# Altium project CM4 IO_V1.10.PrjPcb (part 3 of 5)

## Sheet 11 Power-DC IN.SchDoc: CM4 IO
size 420 x 297 mm; Page Create Date: March  8, 1995; Page Number: 11; Page Size: A3; Comment: radxa_1010; Page Count: 19; RevCode: V1.10; Doc: 11 Power-DC IN; DsnPath: D:\WMS\黄工\[RC126]CM4_IO_V1.10\[RC126]_V1.10\CM4 IO_V1.10.DSN; SchematicName: CM4 IO V1.10; PageName: 11 Power-DC IN; PageSize: A3; TopSchematic: True
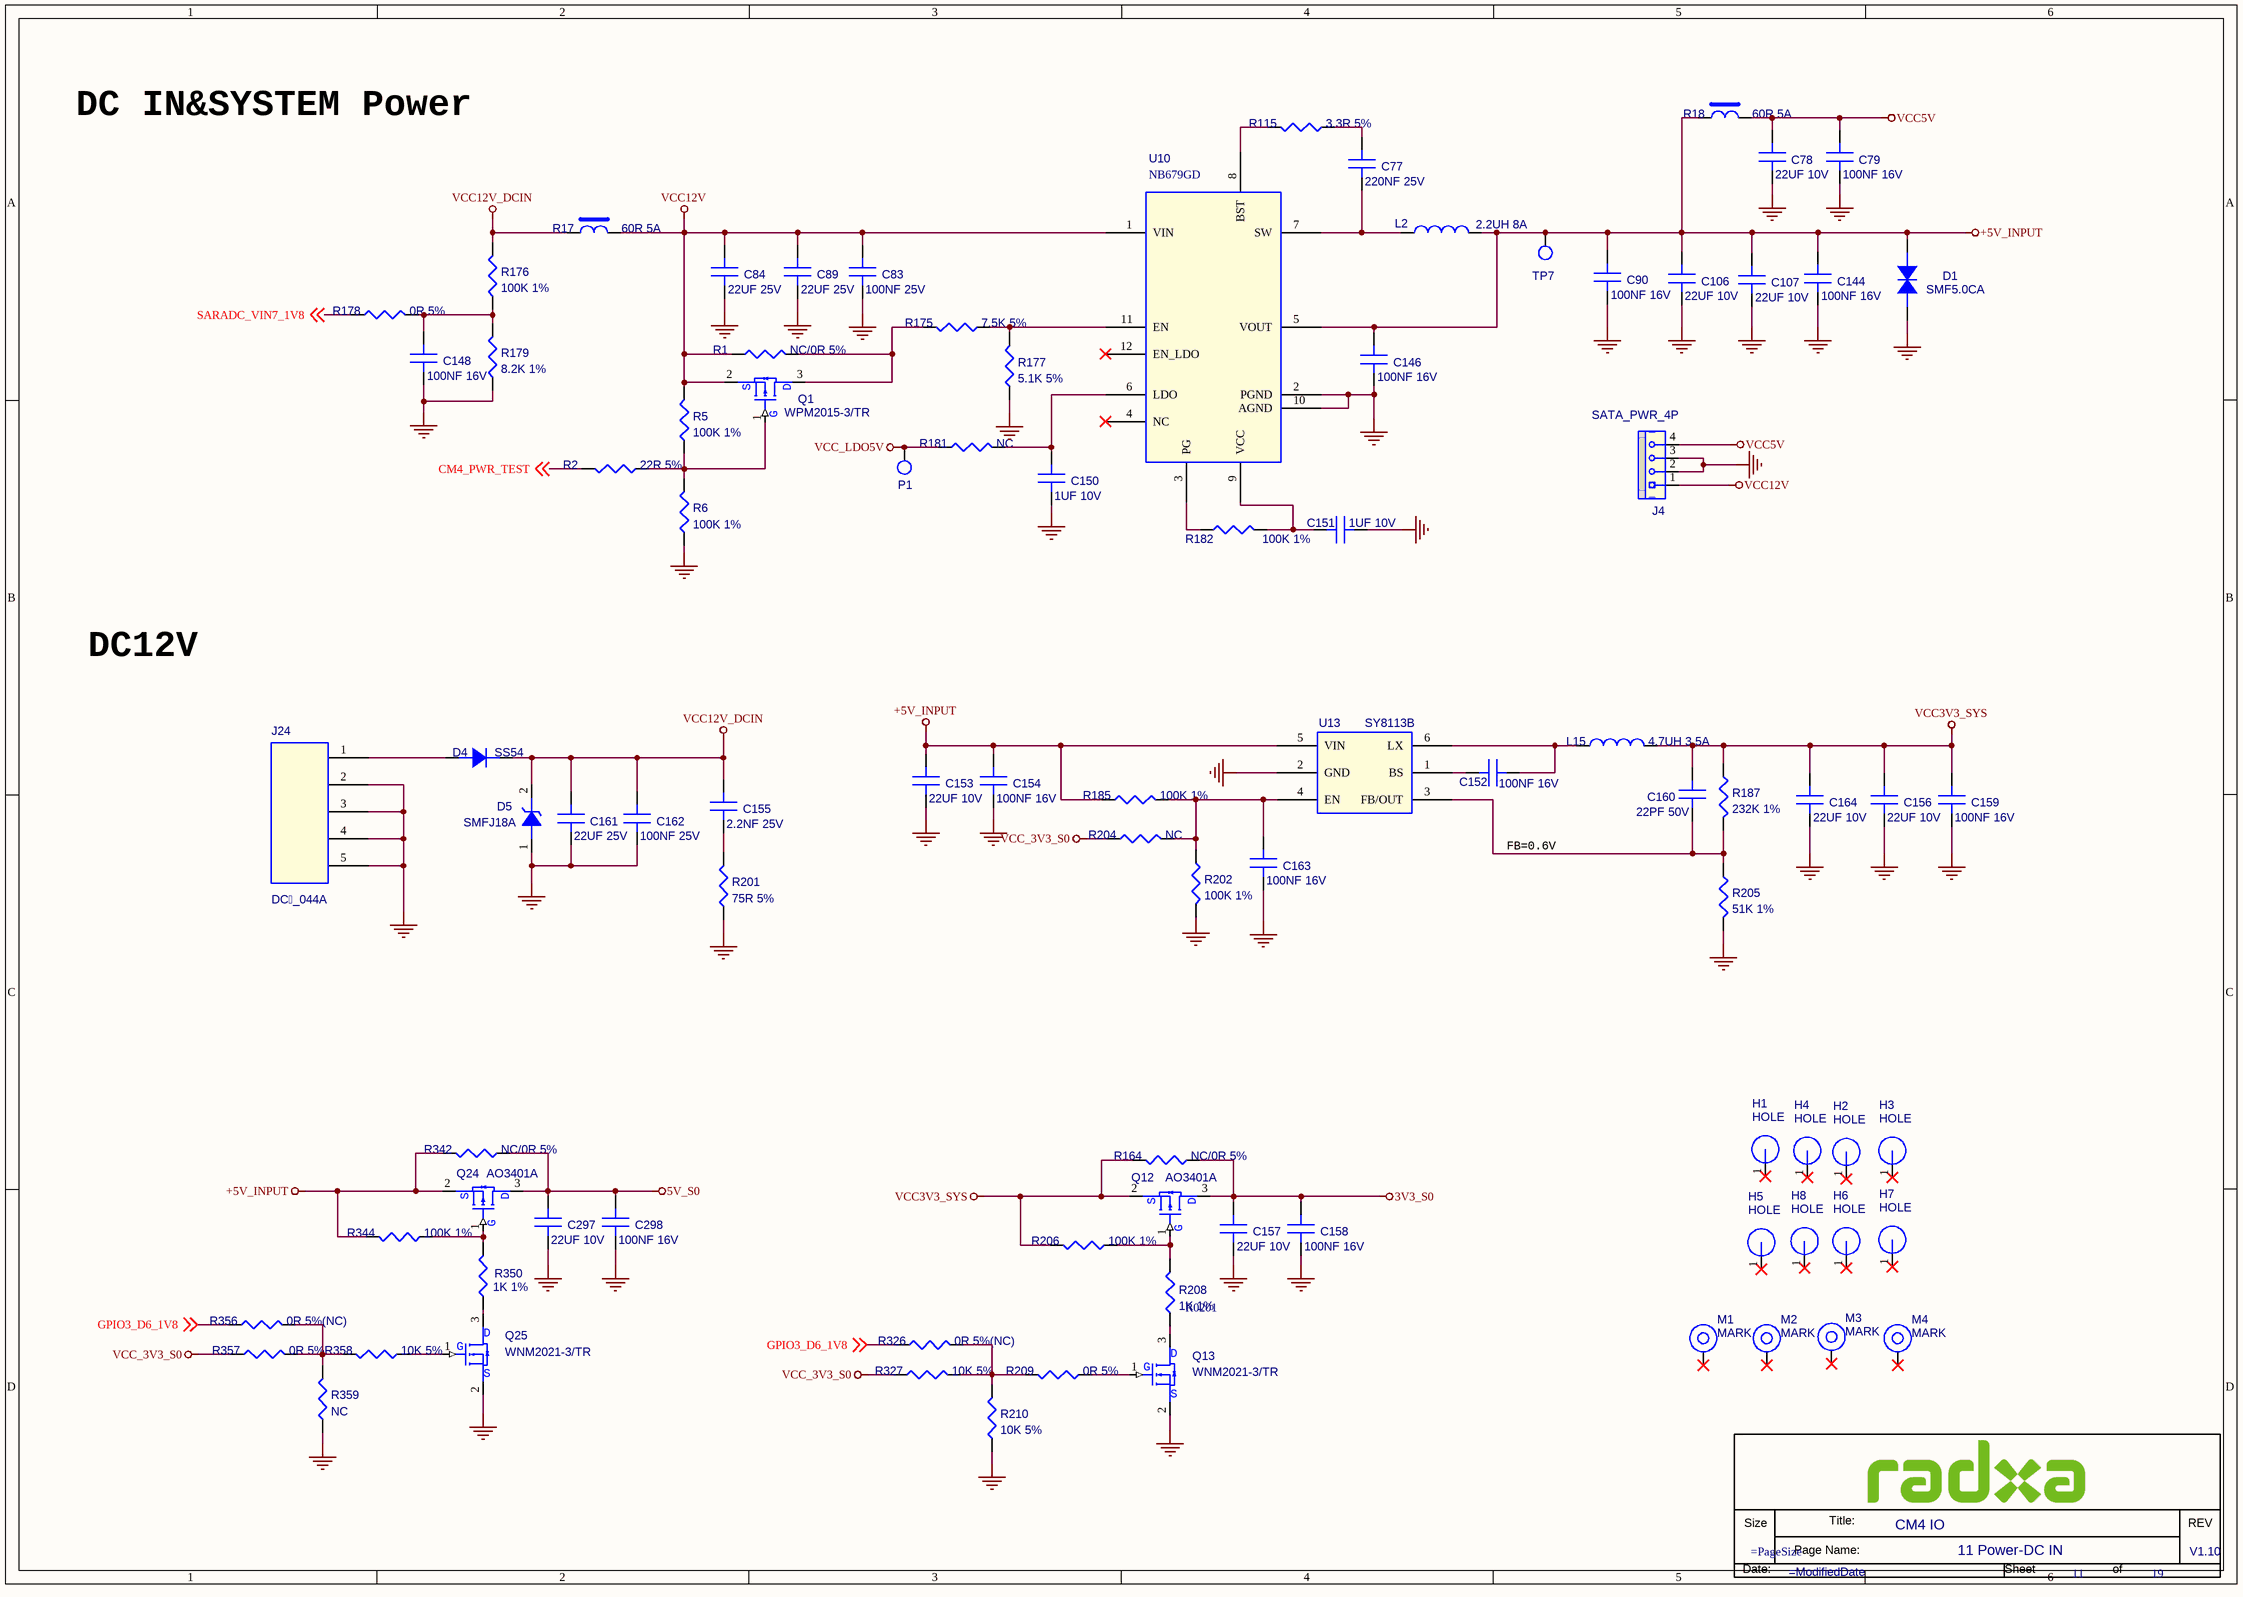
[diagram p9: 11 Power-DC IN.SchDoc]

### Parts
(Parts that share a designator on the sheet are numbered #1, #2 ... from top to bottom, then left to right.)
*#10  Doc: 11 Power-DC IN  RevCode: V1.10  Title: CM4 IO  Page Number: 11  Page Count: 19  (hidden comment: radxa_1010)  (graphical)
C77  220NF 25V  [C0201]
C78  22UF 10V  [C0603]
C79  100NF 16V  [C0201]
C83  100NF 25V  [C0201]
C84  22UF 25V  [C0805]
C89  22UF 25V  [C0805]
C90  100NF 16V  [C0201]
C106  22UF 10V  [C0603]
C107  22UF 10V  [C0603]
C144  100NF 16V  [C0201]
C146  100NF 16V  [C0201]
C148  100NF 16V  [C0201]
C150  1UF 10V  [C0201]
C151  1UF 10V  [C0201]
C152  100NF 16V  [C0201]
C153  22UF 10V  [C0603]
C154  100NF 16V  [C0201]
C155  2.2NF 25V  [C0201]
C156  22UF 10V  [C0603]
C157  22UF 10V  [C0603]
C158  100NF 16V  [C0201]
C159  100NF 16V  [C0201]
C160  22PF 50V  [C0201]
C161  22UF 25V  [C0805]
C162  100NF 25V  [C0201]
C163  100NF 16V  [C0201]
C164  22UF 10V  [C0603]
C297  22UF 10V  [C0603]
C298  100NF 16V  [C0201]
D1  SMF5.0CA  [SOD_123]
D4  SS54  [DO_214AC]
D5  SMFJ18A  [SOD_123]
H1  HOLE  [H3.8MM]
H2  HOLE  [H3.8MM]
H3  HOLE  [H3.8MM]
H4  HOLE  [H3.8MM]
H5  HOLE  [H3.8MM]
H6  HOLE  [H3.8MM]
H7  HOLE  [H3.8MM]
H8  HOLE  [H3.8MM]
J4  SATA_PWR_4P  [CON_TH1X4_2D54_SATA]
J24  DC_044A  [DC_TH5_12X10]
L2  2.2UH 8A  [L_6050]
L15  4.7UH 3.5A  [L_5020]
M1  MARK  [MARK]
M2  MARK  [MARK]
M3  MARK  [MARK]
M4  MARK  [MARK]
P1  TEST  [TEST]  (value not drawn)
Q1  WPM2015-3/TR  [SOT_23]
Q12  AO3401A  [SOT_23]
Q13  WNM2021-3/TR  [SOT_323]
Q24  AO3401A  [SOT_23]
Q25  WNM2021-3/TR  [SOT_323]
R1  NC/0R 5%  [R0402]
R2  22R 5%  [R0402]
R5  100K 1%  [R0402]
R6  100K 1%  [R0402]
R17  60R 5A  [FB1206]
R18  60R 5A  [FB1206]
R115  3.3R 5%  [R0402]
R164  NC/0R 5%  [R0402]
R175  7.5K 5%  [R0402]
R176  100K 1%  [R0402]
R177  5.1K 5%  [R0402]
R178  0R 5%  [R0402]
R179  8.2K 1%  [R0402]
R181  NC  [R0402]
R182  100K 1%  [R0402]
R185  100K 1%  [R0402]
R187  232K 1%  [R0402]
R201  75R 5%  [R0402]
R202  100K 1%  [R0402]
R204  NC  [R0402]
R205  51K 1%  [R0402]
R206  100K 1%  [R0402]
R208  1K 1%  PCB Footprint: R0201  [R0402]
R209  0R 5%  [R0402]
R210  10K 5%  [R0402]
R326  0R 5%(NC)  [R0402]
R327  10K 5%  [R0402]
R342  NC/0R 5%  [R0402]
R344  100K 1%  [R0402]
R350  1K 1%  [R0402]
R356  0R 5%(NC)  [R0402]
R357  0R 5%  [R0402]
R358  10K 5%  [R0402]
R359  NC  [R0402]
TP7  TP_0.7  [TEST]  (value not drawn)
U10  NB679GD  [QFN12_0D5_2]
U13  SY8113B  [SOT23_6]

### Nets
3V3_S0: C157.1(A) C158.1(A) Q12.3(D) R164.1
5V_S0: C297.1(A) C298.1(A) Q24.3(D) R342.1
+5V_INPUT: C90.1(A) C106.1(A) C107.1(A) C144.1(A) C146.1(A) C153.1(A) C154.1(A) D1.2(CATHODE) L2.2 Q24.2(S) R18.1 R185.1 R342.2 R344.2 TP7.1 U10.5(VOUT) U13.5(VIN)
GND: C78.2(B) C79.2(B) C83.2(B) C84.2(B) C89.2(B) C90.2(B) C106.2(B) C107.2(B) C144.2(B) C146.2(B) C148.2(B) C150.2(B) C151.2(B) C153.2(B) C154.2(B) C156.2(B) C157.2(B) C158.2(B) C159.2(B) C161.1(A) C162.2(B) C163.2(B) C164.2(B) C297.2(B) C298.2(B) D1.1(ANODE) D5.1(ANODE) J4.2 J4.3 J24.2 J24.3 J24.4 J24.5 Q13.2(S) Q25.2(S) R6.1 R177.1 R179.1 R201.1 R202.2 R205.2 R210.2 R359.2 U10.2(PGND) U10.10(AGND) U13.2(GND)
VCC3V3_SYS: C156.1(A) C159.1(A) C160.1(A) C164.1(A) L15.2 Q12.2(S) R164.2 R187.1 R206.2
VCC5V: C78.1(A) C79.1(A) J4.4 R18.2
VCC12V: C83.1(A) C84.1(A) C89.1(A) J4.1 Q1.2(S) R1.1 R5.2 R17.2 U10.1(VIN)
VCC12V_DCIN: C155.1(A) C161.2(B) C162.1(A) D4.2(K) D5.2(CATHODE) R17.1 R176.2
VCC_3V3_S0: R204.1 R327.1 R357.1
VCC_LDO5V: P1.1 R181.1
CM4_PWR_TEST: R2.1 ; off-sheet CM4_PWR_TEST
GPIO3_D6_1V8: R326.1 R356.1 ; off-sheet GPIO3_D6_1V8
SARADC_VIN7_1V8: R178.1 ; off-sheet SARADC_VIN7_1V8
NetC77_1: C77.1(A) R115.2
NetC77_2: C77.2(B) L2.1 U10.7(SW)
NetC148_1: C148.1(A) R176.1 R178.2 R179.2
NetC150_1: C150.1(A) R181.2 U10.6(LDO)
NetC151_1: C151.1(A) R182.2 U10.9(VCC)
NetC152_1: C152.1(A) U13.1(BS)
NetC152_2: C152.2(B) L15.1 U13.6(LX)
NetC155_2: C155.2(B) R201.2
NetC160_2: C160.2(B) R187.2 R205.1 U13.3(FB/OUT)
NetC163_1: C163.1(A) R185.2 R202.1 R204.2 U13.4(EN)
NetD4_1: D4.1(A) J24.1
NetQ1_1: Q1.1(G) R2.2 R5.1 R6.2
NetQ1_3: Q1.3(D) R1.2 R175.2
NetQ12_1: Q12.1(G) R206.1 R208.1
NetQ13_1: Q13.1(G) R209.1
NetQ13_3: Q13.3(D) R208.2
NetQ24_1: Q24.1(G) R344.1 R350.1
NetQ25_1: Q25.1(G) R358.1
NetQ25_3: Q25.3(D) R350.2
NetR115_1: R115.1 U10.8(BST)
NetR175_1: R175.1 R177.2 U10.11(EN)
NetR182_1: R182.1 U10.3(PG)
NetR209_2: R209.2 R210.1 R326.2 R327.2
NetR356_2: R356.2 R357.2 R358.2 R359.1

Not connected (* = marked no-connect by the designer): H1 1*; H2 1*; H3 1*; H4 1*; H5 1*; H6 1*; H7 1*; H8 1*; M1 1*; M2 1*; M3 1*; M4 1*; U10 4(NC)* 12(EN_LDO)*

### Notes on the sheet
- DC IN&SYSTEM Power
- DC12V
- FB=0.6V
- (in symbol radxa_1010) Size; Title:; REV; Page Name:; Date:; Sheet; of

### Library data of the parts
C77 = C: SMD  0201  220NF  25V  X5R  ±10%  ROHS; PARTS: 1; Part Reference: C77; Part Number: A1C01.00365; OriginalSymbolOrigin: (0,30); PKG_TYPE: CAP2-100-250; LEVEL: STD; PINSWAP: (A,B); Preferred: 6715f349cd0bc5; Value: 220NF 25V; Part Type: 陶瓷电容; PCB Footprint: C0201
C78 = C: SMD  0603  22UF  10V  X5R  ±20%  ROHS; PARTS: 1; Part Reference: C78; Part Number: A1C01.00015; OriginalSymbolOrigin: (0,30); PKG_TYPE: CAP2-100-250; LEVEL: STD; PINSWAP: (A,B); Preferred: 6715f349cd0bc5; Value: 22UF 10V; Part Type: 陶瓷电容; PCB Footprint: C0603
C79 = C: SMD  0201  100NF  16V  X5R  ±20%  ROHS; PARTS: 1; Part Reference: C79; Part Number: A1C01.00099; OriginalSymbolOrigin: (0,30); PKG_TYPE: CAP2-100-250; LEVEL: STD; PINSWAP: (A,B); Preferred: 6715f349cd0bc5; Value: 100NF 16V; Part Type: 陶瓷电容; PCB Footprint: C0201
C83 = C: SMD  0201  100NF  25V  X5R  ±20%  ROHS; PARTS: 1; Part Reference: C83; Part Number: A1C01.00101; OriginalSymbolOrigin: (0,30); PKG_TYPE: CAP2-100-250; LEVEL: STD; PINSWAP: (A,B); Preferred: 6715f349cd0bc5; Value: 100NF 25V; Part Type: 陶瓷电容; PCB Footprint: C0201
C84 = C: SMD  0805  22UF  25V  X5R  ±20%  ROHS; PARTS: 1; Part Reference: C84; Part Number: A1C01.00249; OriginalSymbolOrigin: (0,30); PKG_TYPE: CAP2-100-250; LEVEL: STD; PINSWAP: (A,B); Preferred: 6715f349cd0bc5; Value: 22UF 25V; Part Type: 陶瓷电容; PCB Footprint: C0805
C89 = C: SMD  0805  22UF  25V  X5R  ±20%  ROHS; PARTS: 1; Part Reference: C89; Part Number: A1C01.00249; OriginalSymbolOrigin: (0,30); PKG_TYPE: CAP2-100-250; LEVEL: STD; PINSWAP: (A,B); Preferred: 6715f349cd0bc5; Value: 22UF 25V; Part Type: 陶瓷电容; PCB Footprint: C0805
C90 = C: SMD  0201  100NF  16V  X5R  ±20%  ROHS; PARTS: 1; Part Reference: C90; Part Number: A1C01.00099; OriginalSymbolOrigin: (0,30); PKG_TYPE: CAP2-100-250; LEVEL: STD; PINSWAP: (A,B); Preferred: 6715f349cd0bc5; Value: 100NF 16V; Part Type: 陶瓷电容; PCB Footprint: C0201
C106 = C: SMD  0603  22UF  10V  X5R  ±20%  ROHS; PARTS: 1; Part Reference: C106; Part Number: A1C01.00015; OriginalSymbolOrigin: (0,30); PKG_TYPE: CAP2-100-250; LEVEL: STD; PINSWAP: (A,B); Preferred: 6715f349cd0bc5; Value: 22UF 10V; Part Type: 陶瓷电容; PCB Footprint: C0603
C107 = C: SMD  0603  22UF  10V  X5R  ±20%  ROHS; PARTS: 1; Part Reference: C107; Part Number: A1C01.00015; OriginalSymbolOrigin: (0,30); PKG_TYPE: CAP2-100-250; LEVEL: STD; PINSWAP: (A,B); Preferred: 6715f349cd0bc5; Value: 22UF 10V; Part Type: 陶瓷电容; PCB Footprint: C0603
C144 = C: SMD  0201  100NF  16V  X5R  ±20%  ROHS; PARTS: 1; Part Reference: C144; Part Number: A1C01.00099; OriginalSymbolOrigin: (0,30); PKG_TYPE: CAP2-100-250; LEVEL: STD; PINSWAP: (A,B); Preferred: 6715f349cd0bc5; Value: 100NF 16V; Part Type: 陶瓷电容; PCB Footprint: C0201
C146 = C: SMD  0201  100NF  16V  X5R  ±20%  ROHS; PARTS: 1; Part Reference: C146; Part Number: A1C01.00099; OriginalSymbolOrigin: (0,30); PKG_TYPE: CAP2-100-250; LEVEL: STD; PINSWAP: (A,B); Preferred: 6715f349cd0bc5; Value: 100NF 16V; Part Type: 陶瓷电容; PCB Footprint: C0201
C148 = C: SMD  0201  100NF  16V  X5R  ±20%  ROHS; PARTS: 1; Part Reference: C148; Part Number: A1C01.00099; OriginalSymbolOrigin: (0,30); PKG_TYPE: CAP2-100-250; LEVEL: STD; PINSWAP: (A,B); Preferred: 6715f349cd0bc5; Value: 100NF 16V; Part Type: 陶瓷电容; PCB Footprint: C0201
C150 = C: SMD  0201  1UF  10V  X5R  ±20%  ROHS; PARTS: 1; Part Reference: C150; Part Number: A1C01.00081; OriginalSymbolOrigin: (0,30); PKG_TYPE: CAP2-100-250; LEVEL: STD; PINSWAP: (A,B); Preferred: 6715f349cd0bc5; Value: 1UF 10V; Part Type: 陶瓷电容; PCB Footprint: C0201
C151 = C: SMD  0201  1UF  10V  X5R  ±20%  ROHS; PARTS: 1; Part Reference: C151; Part Number: A1C01.00081; OriginalSymbolOrigin: (0,30); PKG_TYPE: CAP2-100-250; LEVEL: STD; PINSWAP: (A,B); Preferred: 6715f349cd0bc5; Value: 1UF 10V; Part Type: 陶瓷电容
C152 = C: SMD  0201  100NF  16V  X5R  ±20%  ROHS; PARTS: 1; Part Reference: C152; Part Number: A1C01.00099; OriginalSymbolOrigin: (0,30); PKG_TYPE: CAP2-100-250; LEVEL: STD; PINSWAP: (A,B); Preferred: 6715f349cd0bc5; Value: 100NF 16V; Part Type: 陶瓷电容; PCB Footprint: C0201
C153 = C: SMD  0603  22UF  10V  X5R  ±20%  ROHS; PARTS: 1; Part Reference: C153; Part Number: A1C01.00015; OriginalSymbolOrigin: (0,30); PKG_TYPE: CAP2-100-250; LEVEL: STD; PINSWAP: (A,B); Preferred: 6715f349cd0bc5; Value: 22UF 10V; Part Type: 陶瓷电容; PCB Footprint: C0603
C154 = C: SMD  0201  100NF  16V  X5R  ±20%  ROHS; PARTS: 1; Part Reference: C154; Part Number: A1C01.00099; OriginalSymbolOrigin: (0,30); PKG_TYPE: CAP2-100-250; LEVEL: STD; PINSWAP: (A,B); Preferred: 6715f349cd0bc5; Value: 100NF 16V; Part Type: 陶瓷电容; PCB Footprint: C0201
C155 = C: SMD  0201  2.2NF  25V  X7R  ±10%  ROHS; PARTS: 1; Part Reference: C155; Part Number: A1C01.00123; OriginalSymbolOrigin: (0,30); PKG_TYPE: CAP2-100-250; LEVEL: STD; PINSWAP: (A,B); Preferred: 6715f349cd0bc5; Value: 2.2NF 25V; Part Type: 陶瓷电容; PCB Footprint: C0201
C156 = C: SMD  0603  22UF  10V  X5R  ±20%  ROHS; PARTS: 1; Part Reference: C156; Part Number: A1C01.00015; OriginalSymbolOrigin: (0,30); PKG_TYPE: CAP2-100-250; LEVEL: STD; PINSWAP: (A,B); Preferred: 6715f349cd0bc5; Value: 22UF 10V; Part Type: 陶瓷电容; PCB Footprint: C0603
C157 = C: SMD  0603  22UF  10V  X5R  ±20%  ROHS; PARTS: 1; Part Reference: C157; Part Number: A1C01.00015; OriginalSymbolOrigin: (0,30); PKG_TYPE: CAP2-100-250; LEVEL: STD; PINSWAP: (A,B); Preferred: 6715f349cd0bc5; Value: 22UF 10V; Part Type: 陶瓷电容; PCB Footprint: C0603
C158 = C: SMD  0201  100NF  16V  X5R  ±20%  ROHS; PARTS: 1; Part Reference: C158; Part Number: A1C01.00099; OriginalSymbolOrigin: (0,30); PKG_TYPE: CAP2-100-250; LEVEL: STD; PINSWAP: (A,B); Preferred: 6715f349cd0bc5; Value: 100NF 16V; Part Type: 陶瓷电容; PCB Footprint: C0201
C159 = C: SMD  0201  100NF  16V  X5R  ±20%  ROHS; PARTS: 1; Part Reference: C159; Part Number: A1C01.00099; OriginalSymbolOrigin: (0,30); PKG_TYPE: CAP2-100-250; LEVEL: STD; PINSWAP: (A,B); Preferred: 6715f349cd0bc5; Value: 100NF 16V; Part Type: 陶瓷电容; PCB Footprint: C0201
C160 = C: SMD  0201  22PF  50V  NPO  ±5%  ROHS; PARTS: 1; Part Reference: C160; Part Number: A1C01.00021; OriginalSymbolOrigin: (0,30); PKG_TYPE: CAP2-100-250; LEVEL: STD; PINSWAP: (A,B); Preferred: 6715f349cd0bc5; Value: 22PF 50V; Part Type: 陶瓷电容; PCB Footprint: C0201
C161 = C: SMD  0805  22UF  25V  X5R  ±20%  ROHS; PARTS: 1; Part Reference: C161; Part Number: A1C01.00249; OriginalSymbolOrigin: (0,30); PKG_TYPE: CAP2-100-250; LEVEL: STD; PINSWAP: (A,B); Preferred: 6715f349cd0bc5; Value: 22UF 25V; Part Type: 陶瓷电容; PCB Footprint: C0805
C162 = C: SMD  0201  100NF  25V  X5R  ±20%  ROHS; PARTS: 1; Part Reference: C162; Part Number: A1C01.00101; OriginalSymbolOrigin: (0,30); PKG_TYPE: CAP2-100-250; LEVEL: STD; PINSWAP: (A,B); Preferred: 6715f349cd0bc5; Value: 100NF 25V; Part Type: 陶瓷电容; PCB Footprint: C0201
C163 = C: SMD  0201  100NF  16V  X5R  ±20%  ROHS; PARTS: 1; Part Reference: C163; Part Number: A1C01.00099; OriginalSymbolOrigin: (0,30); PKG_TYPE: CAP2-100-250; LEVEL: STD; PINSWAP: (A,B); Preferred: 6715f349cd0bc5; Value: 100NF 16V; Part Type: 陶瓷电容; PCB Footprint: C0201
C164 = C: SMD  0603  22UF  10V  X5R  ±20%  ROHS; PARTS: 1; Part Reference: C164; Part Number: A1C01.00015; OriginalSymbolOrigin: (0,30); PKG_TYPE: CAP2-100-250; LEVEL: STD; PINSWAP: (A,B); Preferred: 6715f349cd0bc5; Value: 22UF 10V; Part Type: 陶瓷电容; PCB Footprint: C0603
C297 = C: SMD  0603  22UF  10V  X5R  ±20%  ROHS; PARTS: 1; Part Reference: C297; Part Number: A1C01.00015; OriginalSymbolOrigin: (0,30); PKG_TYPE: CAP2-100-250; LEVEL: STD; PINSWAP: (A,B); Preferred: 6715f349cd0bc5; Value: 22UF 10V; Part Type: 陶瓷电容; PCB Footprint: C0603
C298 = C: SMD  0201  100NF  16V  X5R  ±20%  ROHS; PARTS: 1; Part Reference: C298; Part Number: A1C01.00099; OriginalSymbolOrigin: (0,30); PKG_TYPE: CAP2-100-250; LEVEL: STD; PINSWAP: (A,B); Preferred: 6715f349cd0bc5; Value: 100NF 16V; Part Type: 陶瓷电容; PCB Footprint: C0201
D1 = DIODE_S: SMD  SOD-123FL  SMF5.0CA  晶导微  ROHS; Part Reference: D1; Part Number: A1D02.00132; Temp Coeff: -55℃ to +150℃; Value: SMF5.0CA; Part Type: 二极管-ESD管-桥堆-TVS管; PCB Footprint: SOD_123
D4 = DIODE: SMD  编带  DO-214AC  SS54  晶导微  ROHS; Part Reference: D4; Manufacturer PN: SS32; Manufacturer: 星海; Part Number: A1D02.00006; Priority: A; ROOM: CHG; Value: SS54; Created by: JJJ; Part Type: 二极管-ESD管-桥堆-TVS管; RK PN: SS32; PCB Footprint: DO_214AC
D5 = TVS: SMD  编带  SOD-123  SMFJ18A  晶导微电子  ROHS; Part Reference: D5; Part Number: A1D02.00007; Preferred: 6715f349cd0bc5; Temp Coeff: -55℃ to +150℃; PCB Footprint: SOD_123; Value: SMFJ18A; Part Type: 二极管-ESD管-桥堆-TVS管
H1 = HOLE: 直径3.5mm hole; Part Reference: H1; PCB Footprint: HOLE_R6_2D7MM; RK PN: HOLE_3R50; Priority: A; Value: HOLE; Part Type: HOLE; Created by: CZD
H2 = HOLE: 直径3.5mm hole; Part Reference: H2; PCB Footprint: HOLE_R6_2D7MM; Priority: A; RK PN: HOLE_3R50; Value: HOLE; Created by: CZD; Part Type: HOLE
H3 = HOLE: 直径3.5mm hole; Part Reference: H3; PCB Footprint: HOLE_R6_2D7MM; Priority: A; RK PN: HOLE_3R50; Value: HOLE; Created by: CZD; Part Type: HOLE
H4 = HOLE: 直径3.5mm hole; Part Reference: H4; PCB Footprint: HOLE_R6_2D7MM; Priority: A; RK PN: HOLE_3R50; Value: HOLE; Created by: CZD; Part Type: HOLE
H5 = HOLE: 直径3.5mm hole; Part Reference: H5; PCB Footprint: HOLE_R6_2D7MM; RK PN: HOLE_3R50; Priority: A; Value: HOLE; Part Type: HOLE; Created by: CZD
H6 = HOLE: 直径3.5mm hole; Part Reference: H6; PCB Footprint: HOLE_R6_2D7MM; RK PN: HOLE_3R50; Priority: A; Value: HOLE; Part Type: HOLE; Created by: CZD
H7 = HOLE: 直径3.5mm hole; Part Reference: H7; PCB Footprint: HOLE_R6_2D7MM; Priority: A; RK PN: HOLE_3R50; Value: HOLE; Created by: CZD; Part Type: HOLE
H8 = HOLE: 直径3.5mm hole; Part Reference: H8; PCB Footprint: HOLE_R6_2D7MM; Priority: A; RK PN: HOLE_3R50; Value: HOLE; Created by: CZD; Part Type: HOLE
J4 = SATA_PWR_4P: DIP  排针座  1*4PIN  180度  无定位柱  2.54mm脚距  针长一端8.3mm  另一端3.5mm  小4PIN  白色  M2545V-4P  兴飞  ROHS; Part Reference: J4; Part Number: A1J01.00014; Value: SATA_PWR_4P; Part Type: 排座
J24 = DC_044A_5520: DIP  5PIN  DS-044BS  内孔Φ6mm  铁芯Φ2.0mm  11.6*10.2*7.3mm  协佳  ROHS; Part Reference: J24; Part Number: A1J11.00007; Temp Coeff: NA; Preferred: 6715f352cd0bcd; Part Type: DC座
L2 = L: SMD  带屏蔽  7.2x6.6x5mm  2.2UH  8A  ±20%  RXWSHC0650-2R2M  仁芯微  ROHS; Part Reference: L2; Part Number: A1L01.00163; Preferred: 6715f349cd0bc5; Temp Coeff: -55℃ to +125℃; PCB Footprint: L_6050; Value: 2.2UH 8A; Part Type: 贴片功率电感
L15 = L: SMD  带屏蔽  5.4*5.2*1.8mm  4.7UH  3.5A  ±20%  RXWSHC0520-4R7M  仁芯微  ROHS; Part Reference: L15; Part Number: A1L01.00071; Preferred: 6715f349cd0bc5; Temp Coeff: -55℃ to +125℃; PCB Footprint: L_5020; Value: 4.7UH 3.5A; Part Type: 贴片功率电感
M1 = MARK: MARK Symble; Part Reference: M1; Priority: A; RK PN: MARK01; PCB Footprint: MARK; Value: MARK; Created by: JJJ; Part Type: MARK
M2 = MARK: MARK Symble; Part Reference: M2; Priority: A; RK PN: MARK01; PCB Footprint: MARK; Value: MARK; Created by: JJJ; Part Type: MARK
M3 = MARK: MARK Symble; Part Reference: M3; RK PN: MARK01; Priority: A; PCB Footprint: MARK; Value: MARK; Part Type: MARK; Created by: JJJ
M4 = MARK: MARK Symble; Part Reference: M4; RK PN: MARK01; Priority: A; PCB Footprint: MARK; Value: MARK; Part Type: MARK; Created by: JJJ
P1 = TESTPOINT1: Part Reference: P1; PCB Footprint: TP_0R70; Value: TEST
Q1 = MOSFET_PNP: SMD编带  SOT-23  WPM2015-3/TR  P沟道  ROHS; Part Reference: Q1; Part Number: A1D01.00019; Temp Coeff: -55℃ to ＋150℃; Value: WPM2015-3/TR; Part Type: 三极管-MOS管; PCB Footprint: SOT_23
Q12 = MOSFET_PNP: SMD  编带  SOT23-3  AO3401A  P沟道  AOS  ROHS; Part Reference: Q12; Part Number: A1D01.00034; Temp Coeff: -55℃ to ＋150℃; Value: AO3401A; Part Type: 三极管-MOS管; PCB Footprint: SOT_23
Q13 = MOSFET_NPN: SMD编带  SOT-323  WILLSEMI(韦尔)  WNM2021-3/TR  N沟道  ROHS; Part Reference: Q13; Part Number: A1D01.00008; Temp Coeff: -55℃ to ＋150℃; Value: WNM2021-3/TR; Part Type: 三极管-MOS管; PCB Footprint: SOT_323
Q24 = MOSFET_PNP: SMD  编带  SOT23-3  AO3401A  P沟道  AOS  ROHS; Part Reference: Q24; Part Number: A1D01.00034; Temp Coeff: -55℃ to ＋150℃; Value: AO3401A; Part Type: 三极管-MOS管; PCB Footprint: SOT_23
Q25 = MOSFET_NPN: SMD编带  SOT-323  WILLSEMI(韦尔)  WNM2021-3/TR  N沟道  ROHS; Part Reference: Q25; Part Number: A1D01.00008; Temp Coeff: -55℃ to ＋150℃; Value: WNM2021-3/TR; Part Type: 三极管-MOS管; PCB Footprint: SOT_323
R1 = R: SMD  0201  0R  1/20W  ±5%  ROHS; Part Reference: R1; Part Number: A1R01.00027; PCB Footprint: R0201; Temp Coeff: -55℃ to +125℃; Preferred: 6715f349cd0bc5; Value: NC/0R 5%; Part Type: 贴片电阻
R2 = R: SMD  0201  22R  1/20W  ±5%  ROHS; Part Reference: R2; Part Number: A1R01.00024; PCB Footprint: R0201; Preferred: 6715f349cd0bc5; Temp Coeff: -55℃ to +125℃; Value: 22R 5%; Part Type: 贴片电阻
R5 = R: SMD  0201  100K  1/20W  ±1%  ROHS; Part Reference: R5; Part Number: A1R01.00165; PCB Footprint: R0201; Preferred: 6715f349cd0bc5; Value: 100K 1%; Part Type: 贴片电阻
R6 = R: SMD  0201  100K  1/20W  ±1%  ROHS; Part Reference: R6; Part Number: A1R01.00165; PCB Footprint: R0201; Preferred: 6715f349cd0bc5; Value: 100K 1%; Part Type: 贴片电阻
R17 = BEAD: SMD  1206  FB60R  5A  ±25%  ROHS; Part Reference: R17; Part Number: A1L09.00006; Preferred: 6715f352cd0bcd; Temp Coeff: -40℃ to +105℃; PCB Footprint: FB1206; Value: 60R 5A; Part Type: 贴片磁珠
R18 = BEAD: SMD  1206  FB60R  5A  ±25%  ROHS; Part Reference: R18; Part Number: A1L09.00006; Preferred: 6715f352cd0bcd; Temp Coeff: -40℃ to +105℃; PCB Footprint: FB1206; Value: 60R 5A; Part Type: 贴片磁珠
R115 = R: SMD  0201  3.3R  1/20W  ±5%  ROHS; Part Reference: R115; Part Number: A1R01.00145; PCB Footprint: R0201; Preferred: 6715f349cd0bc5; Temp Coeff: -55℃ to +125℃; Value: 3.3R 5%; Part Type: 贴片电阻
R164 = R: SMD  0402  0R  1/16W  ±5%  ROHS; Part Reference: R164; Part Number: A1R01.00030; Temp Coeff: -55℃ to +155℃; Preferred: 6715f349cd0bc5; PCB Footprint: R0402; Value: NC/0R 5%; Part Type: 贴片电阻
R175 = R: SMD  0201  7.5K  1/20W  ±5%  ROHS; Part Reference: R175; Part Number: A1R01.00495; PCB Footprint: R0201; Temp Coeff: -55℃ to +125℃; Preferred: 6715f349cd0bc5; Value: 7.5K 5%; Part Type: 贴片电阻
R176 = R: SMD  0201  100K  1/20W  ±1%  ROHS; Part Reference: R176; Part Number: A1R01.00165; Preferred: 6715f349cd0bc5; Value: 100K 1%; Part Type: 贴片电阻
R177 = R: SMD  0201  5.1K  1/20W  ±5%  ROHS; Part Reference: R177; Part Number: A1R01.00013; PCB Footprint: R0201; Temp Coeff: -55℃ to +125℃; Preferred: 6715f349cd0bc5; Value: 5.1K 5%; Part Type: 贴片电阻
R178 = R: SMD  0201  0R  1/20W  ±5%  ROHS; Part Reference: R178; Part Number: A1R01.00027; PCB Footprint: R0201; Temp Coeff: -55℃ to +125℃; Preferred: 6715f349cd0bc5; Value: 0R 5%; Part Type: 贴片电阻
R179 = R: SMD  0201  8.2K  1/20W  ±1%  ROHS; Part Reference: R179; Part Number: A1R01.00086; PCB Footprint: R0201; Preferred: 6715f349cd0bc5; Temp Coeff: -55℃ to +125℃; Value: 8.2K 1%; Part Type: 贴片电阻
R181 = R: SMD  0201  0R  1/20W  ±5%  ROHS; Part Reference: R181; Part Number: A1R01.00027; PCB Footprint: R0201; Preferred: 6715f349cd0bc5; Temp Coeff: -55℃ to +125℃; Value: NC; Part Type: 贴片电阻
R182 = R: SMD  0201  100K  1/20W  ±1%  ROHS; Part Reference: R182; Part Number: A1R01.00165; PCB Footprint: R0201; Preferred: 6715f349cd0bc5; Value: 100K 1%; Part Type: 贴片电阻
R185 = R: SMD  0201  100K  1/20W  ±1%  ROHS; Part Reference: R185; Part Number: A1R01.00165; PCB Footprint: R0201; Preferred: 6715f349cd0bc5; Value: 100K 1%; Part Type: 贴片电阻
R187 = R: SMD  0201  232K  1/20W  ±1%  ROHS; Part Reference: R187; Part Number: A1R01.00189; PCB Footprint: R0201; Preferred: 6715f349cd0bc5; Temp Coeff: -55℃ to +125℃; Value: 232K 1%; Part Type: 贴片电阻
R201 = R: SMD  0201  75R  1/20W  ±5%  ROHS; Part Reference: R201; Part Number: A1R01.00395; PCB Footprint: R0201; Temp Coeff: -55℃ to +125℃; Preferred: 6715f349cd0bc5; Value: 75R 5%; Part Type: 贴片电阻
R202 = R: SMD  0201  100K  1/20W  ±1%  ROHS; Part Reference: R202; Part Number: A1R01.00165; PCB Footprint: R0201; Preferred: 6715f349cd0bc5; Value: 100K 1%; Part Type: 贴片电阻
R204 = R: SMD  0201  10K  1/20W  ±5%  ROHS; Part Reference: R204; Part Number: A1R01.00012; PCB Footprint: R0201; Preferred: 6715f349cd0bc5; Temp Coeff: -55℃ to +125℃; Value: NC; Part Type: 贴片电阻
R205 = R: SMD  0201  51K  1/20W  ±1%  ROHS; Part Reference: R205; Part Number: A1R01.00149; PCB Footprint: R0201; Preferred: 6715f349cd0bc5; Temp Coeff: -55℃ to +125℃; Value: 51K 1%; Part Type: 贴片电阻
R206 = R: SMD  0201  100K  1/20W  ±1%  ROHS; Part Reference: R206; Part Number: A1R01.00165; PCB Footprint: R0201; Preferred: 6715f349cd0bc5; Value: 100K 1%; Part Type: 贴片电阻
R208 = R: SMD  0201  1K  1/20W  ±1%  ROHS; Part Reference: R208; Part Number: A1R01.00111; Preferred: 6715f349cd0bc5; Value: 1K 1%; Part Type: 贴片电阻
R209 = R: SMD  0201  10K  1/20W  ±5%  ROHS; Part Reference: R209; Part Number: A1R01.00012; PCB Footprint: R0201; Preferred: 6715f349cd0bc5; Temp Coeff: -55℃ to +125℃; Value: 0R 5%; Part Type: 贴片电阻
R210 = R: SMD  0201  10K  1/20W  ±5%  ROHS; Part Reference: R210; Part Number: A1R01.00012; PCB Footprint: R0201; Preferred: 6715f349cd0bc5; Temp Coeff: -55℃ to +125℃; Value: 10K 5%; Part Type: 贴片电阻
R326 = R: SMD  0201  0R  1/20W  ±5%  ROHS; Part Reference: R326; Part Number: A1R01.00027; PCB Footprint: R0201; Preferred: 6715f349cd0bc5; Temp Coeff: -55℃ to +125℃; Value: 0R 5%(NC); Part Type: 贴片电阻
R327 = R: SMD  0201  0R  1/20W  ±5%  ROHS; Part Reference: R327; Part Number: A1R01.00027; PCB Footprint: R0201; Temp Coeff: -55℃ to +125℃; Preferred: 6715f349cd0bc5; Value: 10K 5%; Part Type: 贴片电阻
R342 = R: SMD  0402  0R  1/16W  ±5%  ROHS; Part Reference: R342; Part Number: A1R01.00030; Temp Coeff: -55℃ to +155℃; Preferred: 6715f349cd0bc5; PCB Footprint: R0402; Value: NC/0R 5%; Part Type: 贴片电阻
R344 = R: SMD  0201  100K  1/20W  ±1%  ROHS; Part Reference: R344; Part Number: A1R01.00165; PCB Footprint: R0201; Preferred: 6715f349cd0bc5; Value: 100K 1%; Part Type: 贴片电阻
R350 = R: SMD  0201  1K  1/20W  ±1%  ROHS; Part Reference: R350; Part Number: A1R01.00111; PCB Footprint: R0201; Preferred: 6715f349cd0bc5; Value: 1K 1%; Part Type: 贴片电阻
R356 = R: SMD  0201  0R  1/20W  ±5%  ROHS; Part Reference: R356; Part Number: A1R01.00027; PCB Footprint: R0201; Temp Coeff: -55℃ to +125℃; Preferred: 6715f349cd0bc5; Value: 0R 5%(NC); Part Type: 贴片电阻
R357 = R: SMD  0201  0R  1/20W  ±5%  ROHS; Part Reference: R357; Part Number: A1R01.00027; PCB Footprint: R0201; Temp Coeff: -55℃ to +125℃; Preferred: 6715f349cd0bc5; Value: 0R 5%; Part Type: 贴片电阻
R358 = R: SMD  0201  10K  1/20W  ±5%  ROHS; Part Reference: R358; Part Number: A1R01.00012; PCB Footprint: R0201; Temp Coeff: -55℃ to +125℃; Preferred: 6715f349cd0bc5; Value: 10K 5%; Part Type: 贴片电阻
R359 = R: SMD  0201  10K  1/20W  ±5%  ROHS; Part Reference: R359; Part Number: A1R01.00012; PCB Footprint: R0201; Preferred: 6715f349cd0bc5; Temp Coeff: -55℃ to +125℃; Value: NC; Part Type: 贴片电阻
TP7 = TP: Test Point 0.7mm; Part Reference: TP7; PCB Footprint: TP_0R70; Priority: A; RK PN: TESTPOINT_0R7; Value: TP_0.7; Created by: JJJ; Part Type: TP
U10 = NB679: SMD  DCDC  NB679GD-Z  QFN12  MPS  ROHS; Part Reference: U10; Part Number: A1I01.00033; Preferred: 6715f349cd0bc5; Temp Coeff: -40°C to +125°C; PCB Footprint: QFN12_0D5_2; Value: NB679GD; Part Type: 集成电路/模块
U13 = SY8113B: SMD  DCDC  SY8113BADC  SOT23-6  silergy(矽力杰)  ROHS; Part Reference: U13; Part Number: A1I01.00093; Preferred: 6715f349cd0bc5; Temp Coeff: -40℃ to +85℃; PCB Footprint: SOT23_6; Value: SY8113B; Part Type: 集成电路/模块
*#10 = radxa_1010: Page Create Date: March  8, 1995; Page Size: =PageSize; Page Modify Date: =ModifiedDate

## Sheet 13 HDMI TX_RTC.SchDoc: CM4 IO
size 297 x 209 mm; Page Create Date: March  8, 1995; Page Number: 13; Page Size: A4; Comment: radxa_1010; Page Count: 19; RevCode: V1.10; Doc: 13 HDMI TX/RTC; DsnPath: D:\WMS\黄工\[RC126]CM4_IO_V1.10\[RC126]_V1.10\CM4 IO_V1.10.DSN; SchematicName: CM4 IO V1.10; PageName: 13 HDMI TX/RTC; PageSize: A4; TopSchematic: True
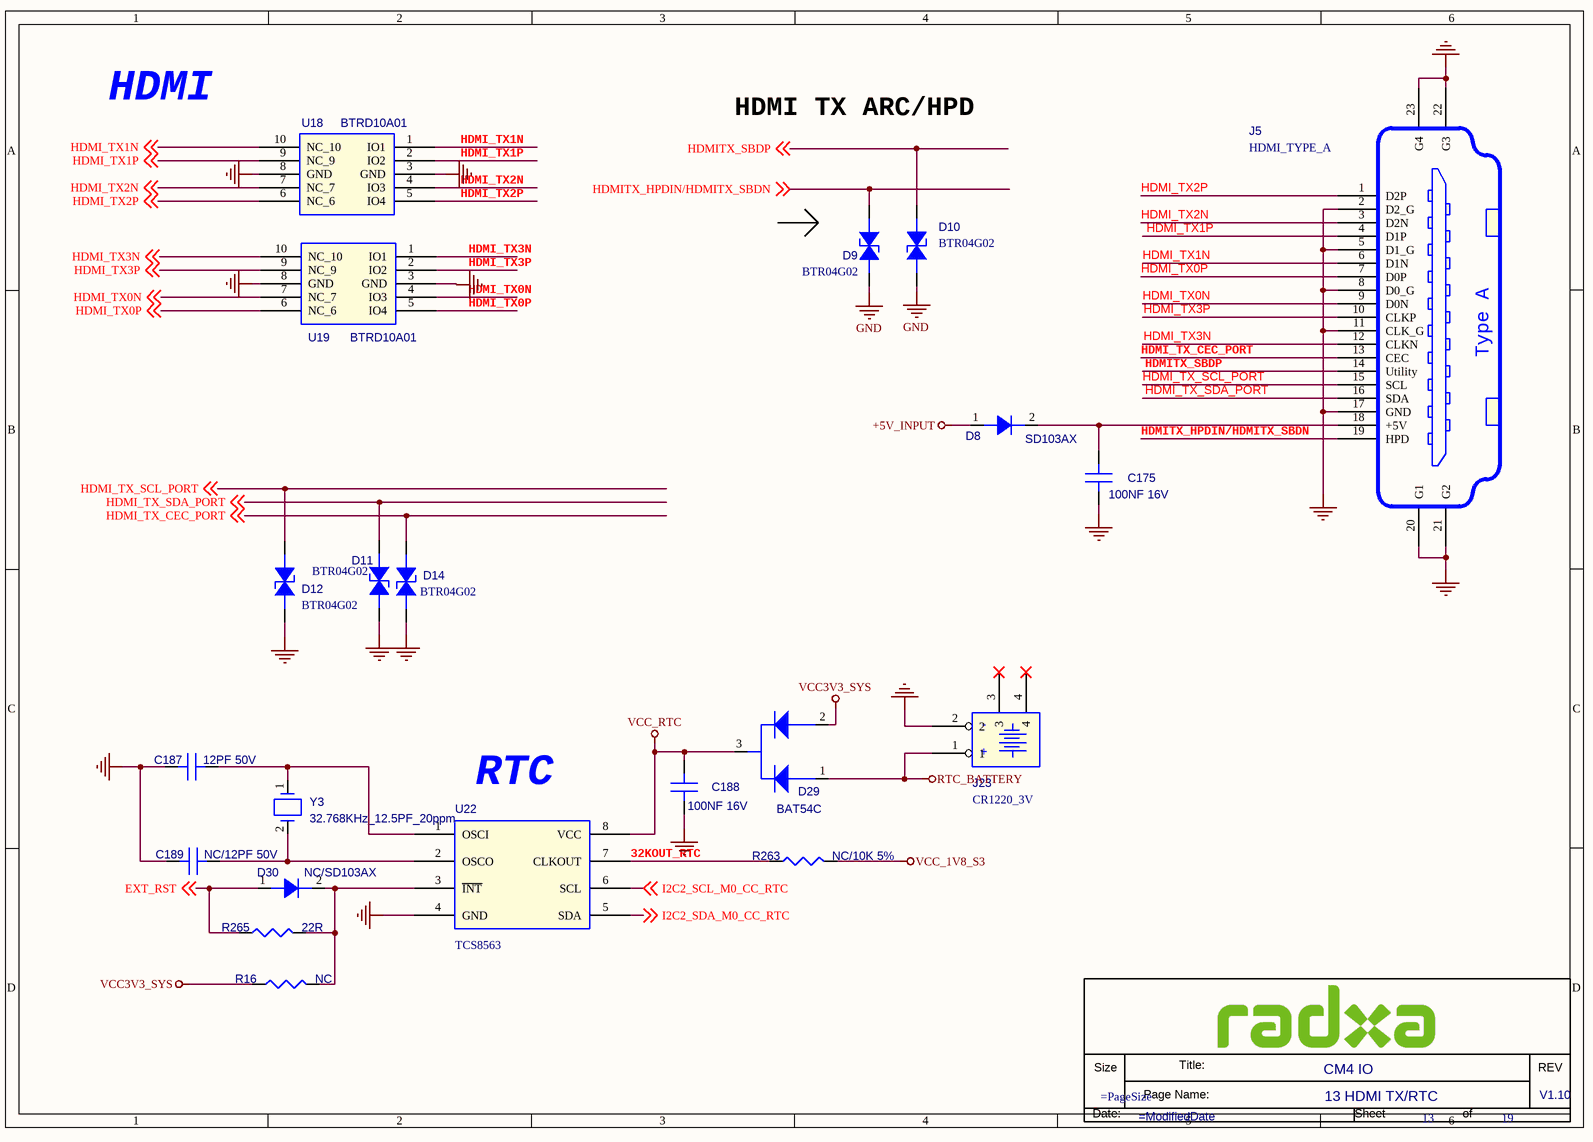
[diagram p10: 13 HDMI TX_RTC.SchDoc]

### Parts
(Parts that share a designator on the sheet are numbered #1, #2 ... from top to bottom, then left to right.)
*#11  Doc: 13 HDMI TX/RTC  RevCode: V1.10  Title: CM4 IO  Page Number: 13  Page Count: 19  (hidden comment: radxa_1010)  (graphical)
C175  100NF 16V  [C0201]
C187  12PF 50V  [C0201]
C188  100NF 16V  [C0201]
C189  NC/12PF 50V  [C0201]
D8  SD103AX  [SOD_523]
D9  BTR04G02  [DFN1006-2L]
D10  BTR04G02  [DFN1006-2L]
D11  BTR04G02  [DFN1006-2L]
D12  BTR04G02  [DFN1006-2L]
D14  BTR04G02  [DFN1006-2L]
D29  BAT54C  [23ACA]
D30  NC/SD103AX  [SOD_523]
J5  HDMI_TYPE_A  [CON_HDMI_TH_19P_STA]
J23  CR1220_3V  [BAT_SM2_12X2]
R16  NC  [R0402]
R263  NC/10K 5%  [R0402]
R265  22R  [R0402]
U18  BTRD10A01  [SON10_0D5_1]
U19  BTRD10A01  [SON10_0D5_1]
U22  TCS8563  [MSOP8_0D65_3]
Y3  32.768KHz_12.5PF_20ppm  [OSC_SM2_3D2X1D5]

### Nets
+5V_INPUT: D8.1(A)
GND: C175.2(B) C187.1(A) C188.2(B) C189.1(A) D9.2(CATHODE) D10.2(CATHODE) D11.2(CATHODE) D12.2(CATHODE) D14.2(CATHODE) J5.2(D2_G) J5.5(D1_G) J5.8(D0_G) J5.11(CLK_G) J5.17(GND) J5.20(G1) J5.21(G2) J5.22(G3) J5.23(G4) J23.2 U18.3(GND) U18.8(GND) U19.3(GND) U19.8(GND) U22.4(GND)
RTC_BATTERY: D29.1(A1) J23.1
VCC3V3_SYS: D29.2(A2) R16.1
VCC_1V8_S3: R263.1
VCC_RTC: C188.1(A) D29.3(C) U22.8(VCC)
32KOUT_RTC: R263.2 U22.7(CLKOUT)
EXT_RST: D30.1(A) R265.1 ; off-sheet EXT_RST
HDMI_TX0N: J5.9(D0N) U19.4(IO3) U19.7(NC_7) ; off-sheet HDMI_TX0N
HDMI_TX0P: J5.7(D0P) U19.5(IO4) U19.6(NC_6) ; off-sheet HDMI_TX0P
HDMI_TX1N: J5.6(D1N) U18.1(IO1) U18.10(NC_10) ; off-sheet HDMI_TX1N
HDMI_TX1P: J5.4(D1P) U18.2(IO2) U18.9(NC_9) ; off-sheet HDMI_TX1P
HDMI_TX2N: J5.3(D2N) U18.4(IO3) U18.7(NC_7) ; off-sheet HDMI_TX2N
HDMI_TX2P: J5.1(D2P) U18.5(IO4) U18.6(NC_6) ; off-sheet HDMI_TX2P
HDMI_TX3N: J5.12(CLKN) U19.1(IO1) U19.10(NC_10) ; off-sheet HDMI_TX3N
HDMI_TX3P: J5.10(CLKP) U19.2(IO2) U19.9(NC_9) ; off-sheet HDMI_TX3P
HDMI_TX_CEC_PORT: D14.1(ANODE) J5.13(CEC) ; off-sheet HDMI_TX_CEC_PORT
HDMI_TX_SCL_PORT: D12.1(ANODE) J5.15(SCL) ; off-sheet HDMI_TX_SCL_PORT
HDMI_TX_SDA_PORT: D11.1(ANODE) J5.16(SDA) ; off-sheet HDMI_TX_SDA_PORT
HDMITX_HPDIN/HDMITX_SBDN: D9.1(ANODE) J5.19(HPD) ; off-sheet HDMITX_HPDIN/HDMITX_SBDN
HDMITX_SBDP: D10.1(ANODE) J5.14(Utility) ; off-sheet HDMITX_SBDP
I2C2_SCL_M0_CC_RTC: U22.6(SCL) ; off-sheet I2C2_SCL_M0_CC_RTC
I2C2_SDA_M0_CC_RTC: U22.5(SDA) ; off-sheet I2C2_SDA_M0_CC_RTC
NetC175_1: C175.1(A) D8.2(K) J5.18(+5V)
NetC187_2: C187.2(B) U22.1(OSCI) Y3.1
NetC189_2: C189.2(B) U22.2(OSCO) Y3.2
NetD30_2: D30.2(K) R16.2 R265.2 U22.3(~{INT})

Not connected (* = marked no-connect by the designer): J23 3* 4*

### Notes on the sheet
- HDMI
- HDMI TX ARC/HPD
- (near U22) RTC
- (in symbol CR1220) -; +
- (in symbol HDMI_TYPE_A) Type A
- (in symbol radxa_1010) Size; Title:; REV; Page Name:; Date:; Sheet; of

### Library data of the parts
C175 = C: SMD  0201  100NF  16V  X5R  ±20%  ROHS; PARTS: 1; Part Reference: C175; Part Number: A1C01.00099; OriginalSymbolOrigin: (0,30); PKG_TYPE: CAP2-100-250; LEVEL: STD; PINSWAP: (A,B); Preferred: 6715f349cd0bc5; Value: 100NF 16V; Part Type: 陶瓷电容
C187 = C: SMD  0201  12PF  50V  COG  ±5%  ROHS; PARTS: 1; Part Reference: C187; Part Number: A1C01.00105; OriginalSymbolOrigin: (0,30); PKG_TYPE: CAP2-100-250; LEVEL: STD; PINSWAP: (A,B); Value: 12PF 50V; PCB Footprint: C0201; Part Type: 陶瓷电容
C188 = C: SMD  0201  100NF  16V  X5R  ±20%  ROHS; PARTS: 1; Part Reference: C188; Part Number: A1C01.00099; OriginalSymbolOrigin: (0,30); PKG_TYPE: CAP2-100-250; LEVEL: STD; PINSWAP: (A,B); Preferred: 6715f349cd0bc5; Value: 100NF 16V; Part Type: 陶瓷电容
C189 = C: SMD  0201  12PF  50V  COG  ±5%  ROHS; PARTS: 1; Part Reference: C189; Part Number: A1C01.00105; OriginalSymbolOrigin: (0,30); PKG_TYPE: CAP2-100-250; LEVEL: STD; PINSWAP: (A,B); Value: NC/12PF 50V; PCB Footprint: C0201; Part Type: 陶瓷电容
D8 = DIODE_Dup1: SMD  编带  SOD-523  SD103AX  CJ  ROHS; Part Reference: D8; Part Number: A1D02.00049; Manufacturer: 长电; RK PN: B5819WS; Priority: A; PCB Footprint: SOD_523; Value: SD103AX; Part Type: 二极管-ESD管-桥堆-TVS管; Manufacturer PN: B5819WS; Created by: JJJ
D9 = ESD: SMD  编带  0402  BTR04G02  B-tron  ROHS; Part Reference: D9; Part Number: A1D02.00002; Parameter: ESD-台舟 ESD5341N-封装 esd0402; ID: DE-E0004; Temp Coeff: -50℃ ~ +125℃; PCB Footprint: ESD_D0402; Value: BTR04G02; Part Type: 二极管-ESD管-桥堆-TVS管
D10 = ESD: SMD  编带  0402  BTR04G02  B-tron  ROHS; Part Reference: D10; Part Number: A1D02.00002; Parameter: ESD-台舟 ESD5341N-封装 esd0402; ID: DE-E0004; Temp Coeff: -50℃ ~ +125℃; PCB Footprint: ESD_D0402; Value: BTR04G02; Part Type: 二极管-ESD管-桥堆-TVS管
D11 = ESD: SMD  编带  0402  BTR04G02  B-tron  ROHS; Part Reference: D11; Part Number: A1D02.00002; Parameter: ESD-台舟 ESD5341N-封装 esd0402; ID: DE-E0004; Temp Coeff: -50℃ ~ +125℃; PCB Footprint: ESD_D0402; Value: BTR04G02; Part Type: 二极管-ESD管-桥堆-TVS管
D12 = ESD: SMD  编带  0402  BTR04G02  B-tron  ROHS; Part Reference: D12; Part Number: A1D02.00002; Parameter: ESD-台舟 ESD5341N-封装 esd0402; ID: DE-E0004; Temp Coeff: -50℃ ~ +125℃; PCB Footprint: ESD_D0402; Value: BTR04G02; Part Type: 二极管-ESD管-桥堆-TVS管
D14 = ESD: SMD  编带  0402  BTR04G02  B-tron  ROHS; Part Reference: D14; Part Number: A1D02.00002; Parameter: ESD-台舟 ESD5341N-封装 esd0402; ID: DE-E0004; Temp Coeff: -50℃ ~ +125℃; PCB Footprint: ESD_D0402; Value: BTR04G02; Part Type: 二极管-ESD管-桥堆-TVS管
D29 = DIODE_S_3P: SMD  编带  SOT-23  BAT54C  30V  0.2A  长电  ROHS; Part Reference: D29; Part Number: A1D02.00096; PCB Footprint: SOT_23; Temp Coeff: -55℃ to +150℃; Preferred: 6715f349cd0bc5; Value: BAT54C; Part Type: 二极管-ESD管-桥堆-TVS管
D30 = DIODE_Dup1: SMD  编带  SOD-523  SD103AX  CJ  ROHS; Part Reference: D30; Part Number: A1D02.00049; Manufacturer: 长电; RK PN: B5819WS; Priority: A; PCB Footprint: SOD_523; Value: NC/SD103AX; Part Type: 二极管-ESD管-桥堆-TVS管; Manufacturer PN: B5819WS; Created by: JJJ
J5 = HDMI_TYPE_A: DIP  TYPE-A  19PIN  180度  23*7.8*H16mm  镀镍  有定位柱  脚距6.5mm  4插件固定脚  WLDM-094E  ROHS; Part Reference: J5; Part Number: A1J13.00003; Parameter: 连接器-HDMI公母-19P/型号：10029449-001RLF-封装 hdmia19_hdmi_01a; Value: HDMI_TYPE_A; Part Type: HDMI座; PCB Footprint: CON_HDMI_TH_19P_STA
J23 = CR1220: SMD  电池座  2PIN  15.4*14.2*4.1mm  BS-12-B2AA002  美阳  ROHS; Part Reference: J23; Part Number: A1J14.00013; Temp Coeff: -25℃ to +85℃; Preferred: 6715f349cd0bc5; Value: CR1220_3V; Part Type: 其他座子
R16 = R: SMD  0201  10K  1/20W  ±5%  ROHS; Part Reference: R16; Part Number: A1R01.00012; PCB Footprint: R0201; Temp Coeff: －55℃ ~ ＋125℃; Value: NC; Part Type: 贴片电阻
R263 = R: SMD  0201  10K  1/20W  ±5%  ROHS; Part Reference: R263; Part Number: A1R01.00012; PCB Footprint: R0201; Temp Coeff: －55℃ ~ ＋125℃; Value: NC/10K 5%; Part Type: 贴片电阻
R265 = R: SMD  0201  0R  1/20W  ±5%  ROHS; Part Reference: R265; Part Number: A1R01.00027; PCB Footprint: R0201; Temp Coeff: －55℃ ~ ＋125℃; Value: 22R; Part Type: 贴片电阻
U18 = BTRD10A01: SMD  编带  DFN2510-10L  BTRD10A01  4Line  0.1pF  B-tron  ROHS; Part Reference: U18; Part Number: A1D02.00106; Temp Coeff: -55℃ to +125℃; Preferred: 6715f349cd0bc5; Value: BTRD10A01; Part Type: 二极管-ESD管-桥堆-TVS管
U19 = BTRD10A01: SMD  编带  DFN2510-10L  BTRD10A01  4Line  0.1pF  B-tron  ROHS; Part Reference: U19; Part Number: A1D02.00106; Temp Coeff: -55℃ to +125℃; Preferred: 6715f349cd0bc5; Value: BTRD10A01; Part Type: 二极管-ESD管-桥堆-TVS管
U22 = TCS8563: SMD  时钟  TCS8563-MH  MSOP8  TCS(汤诚)  ROHS; Part Reference: U22; Part Number: A1I01.00268; Preferred: 6715f349cd0bc5; Temp Coeff: -30℃ to +85℃; Value: TCS8563; PCB Footprint: MSOP8_0D65_3; Part Type: 集成电路/模块
Y3 = OSC_2P: SMD  编带  无源  3215  32.768KHz  12.5PF  ±20ppm  TAITIEN  XDMCZLNDDD-32.768KHz  ROHS; Part Reference: Y3; Part Number: A1Y01.00037; PCB Footprint: OSC_SM2_3D2X1D5; Value: 32.768KHz_12.5PF_20ppm; Part Type: 晶振
*#11 = radxa_1010: Page Create Date: March  8, 1995; Page Size: =PageSize; Page Modify Date: =ModifiedDate

## Sheet 14 ETHERNET.SchDoc: CM4 IO
size 297 x 209 mm; Page Create Date: March  8, 1995; Page Number: 14; Page Size: A4; Comment: radxa_1010; Page Count: 19; RevCode: V1.10; Doc: 14 ETHERNET; DsnPath: D:\WMS\黄工\[RC126]CM4_IO_V1.10\[RC126]_V1.10\CM4 IO_V1.10.DSN; SchematicName: CM4 IO V1.10; PageName: 14 ETHERNET; PageSize: A4; TopSchematic: True
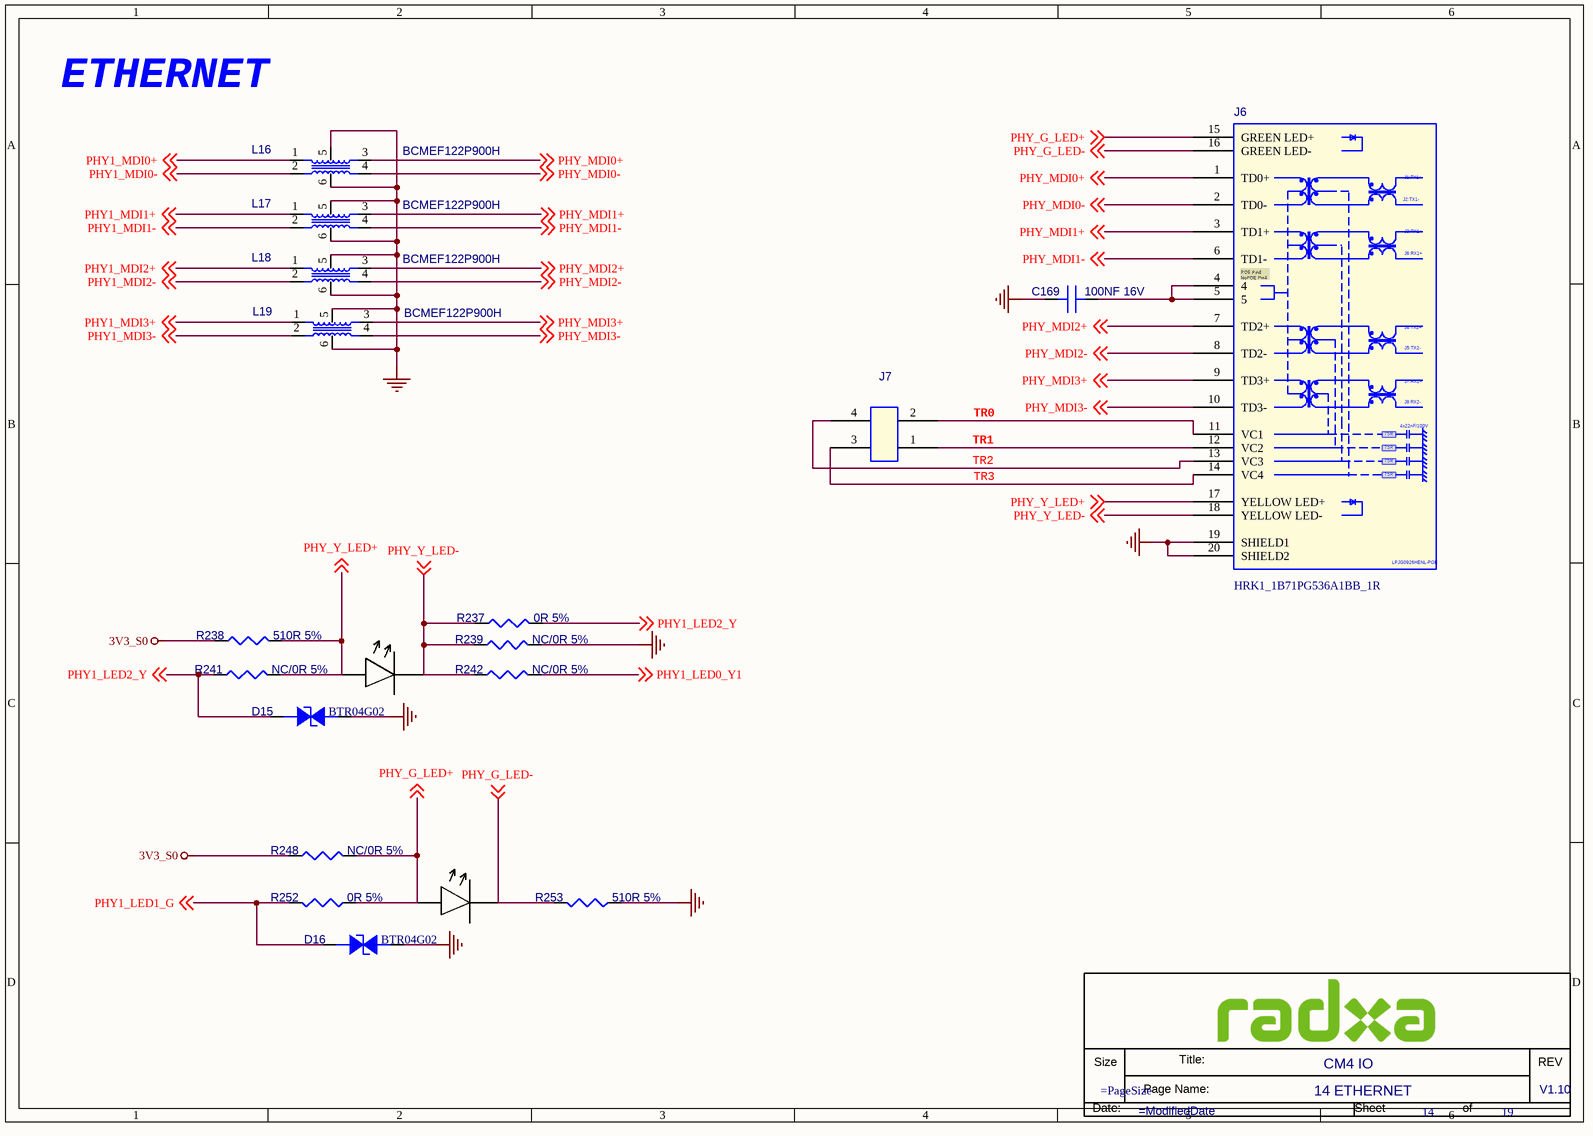
[diagram p11: 14 ETHERNET.SchDoc]

### Parts
(Parts that share a designator on the sheet are numbered #1, #2 ... from top to bottom, then left to right.)
*#12  Doc: 14 ETHERNET  RevCode: V1.10  Title: CM4 IO  Page Number: 14  Page Count: 19  (hidden comment: radxa_1010)  (graphical)
C169  100NF 16V  [C0201]
D15  BTR04G02  [DFN1006-2L]
D16  BTR04G02  [DFN1006-2L]
J6  HRK1_1B71PG536A1BB_1R  [RJ45_LED_TH22_LIE]
J7  (no value)  [CONM_TH2X2_2D54_STA]
L16  BCMEF122P900H  [CML_SM6_0D6_1D5]
L17  BCMEF122P900H  [CML_SM6_0D6_1D5]
L18  BCMEF122P900H  [CML_SM6_0D6_1D5]
L19  BCMEF122P900H  [CML_SM6_0D6_1D5]
R237  0R 5%  [R0402]
R238  510R 5%  [R0402]
R239  NC/0R 5%  [R0402]
R241  NC/0R 5%  [R0402]
R242  NC/0R 5%  [R0402]
R248  NC/0R 5%  [R0402]
R252  0R 5%  [R0402]
R253  510R 5%  [R0402]

### Nets
3V3_S0: R238.1 R248.2
GND: C169.1(A) D15.2(CATHODE) D16.2(CATHODE) J6.19(SHIELD1) J6.20(SHIELD2) L16.5 L16.6 L17.5 L17.6 L18.5 L18.6 L19.5 L19.6 R239.1 R253.2
PHY1_LED0_Y1: R242.2 ; off-sheet PHY1_LED0_Y1
PHY1_LED1_G: D16.1(ANODE) R252.1 ; off-sheet PHY1_LED1_G
PHY1_LED2_Y: D15.1(ANODE) R237.2 R241.1 ; off-sheet PHY1_LED2_Y
PHY1_MDI0+: L16.1(R1) ; off-sheet PHY1_MDI0+
PHY1_MDI0-: L16.2(R2) ; off-sheet PHY1_MDI0-
PHY1_MDI1+: L17.1(R1) ; off-sheet PHY1_MDI1+
PHY1_MDI1-: L17.2(R2) ; off-sheet PHY1_MDI1-
PHY1_MDI2+: L18.1(R1) ; off-sheet PHY1_MDI2+
PHY1_MDI2-: L18.2(R2) ; off-sheet PHY1_MDI2-
PHY1_MDI3+: L19.1(R1) ; off-sheet PHY1_MDI3+
PHY1_MDI3-: L19.2(R2) ; off-sheet PHY1_MDI3-
PHY_G_LED+: J6.15(GREEN_LED+) R248.1 R252.2 ; off-sheet PHY_G_LED+
PHY_G_LED-: J6.16(GREEN_LED-) R253.1 ; off-sheet PHY_G_LED-
PHY_MDI0+: J6.1(TD0+) L16.3(R4) ; off-sheet PHY_MDI0+
PHY_MDI0-: J6.2(TD0-) L16.4(R3) ; off-sheet PHY_MDI0-
PHY_MDI1+: J6.3(TD1+) L17.3(R4) ; off-sheet PHY_MDI1+
PHY_MDI1-: J6.6(TD1-) L17.4(R3) ; off-sheet PHY_MDI1-
PHY_MDI2+: J6.7(TD2+) L18.3(R4) ; off-sheet PHY_MDI2+
PHY_MDI2-: J6.8(TD2-) L18.4(R3) ; off-sheet PHY_MDI2-
PHY_MDI3+: J6.9(TD3+) L19.3(R4) ; off-sheet PHY_MDI3+
PHY_MDI3-: J6.10(TD3-) L19.4(R3) ; off-sheet PHY_MDI3-
PHY_Y_LED+: J6.17(YELLOW_LED+) R238.2 R241.2 ; off-sheet PHY_Y_LED+
PHY_Y_LED-: J6.18(YELLOW_LED-) R237.1 R239.2 R242.1 ; off-sheet PHY_Y_LED-
TR0: J6.11(VC1) J7.2
TR1: J6.12(VC2) J7.1
TR2: J6.13(VC3) J7.4
TR3: J6.14(VC4) J7.3
NetC169_2: C169.2(B) J6.4 J6.5

### Notes on the sheet
- ETHERNET
- (in symbol LPJG0926HENL) J1:TX1+; J2:TX1-; J3:RX1+; J6:RX1+; POE:Pin6 / NoPOE:Pin4; J4:TX2+; J5:TX2-; J7:RX2+; J8:RX2-; 4x22nF/100V; 75R; LPJG0926HENL-POE
- (in symbol radxa_1010) Size; Title:; REV; Page Name:; Date:; Sheet; of

### Library data of the parts
C169 = C: SMD  0201  100NF  16V  X5R  ±20%  ROHS; PARTS: 1; Part Reference: C169; Part Number: A1C01.00099; OriginalSymbolOrigin: (0,30); PKG_TYPE: CAP2-100-250; LEVEL: STD; PINSWAP: (A,B); Preferred: 6715f349cd0bc5; Value: 100NF 16V; Part Type: 陶瓷电容
D15 = ESD: SMD  编带  0402  BTR04G02  B-tron  ROHS; Part Reference: D15; Part Number: A1D02.00002; Parameter: ESD-台舟 ESD5341N-封装 esd0402; ID: DE-E0004; Temp Coeff: -50℃ ~ +125℃; PCB Footprint: ESD_D0402; Value: BTR04G02; Part Type: 二极管-ESD管-桥堆-TVS管
D16 = ESD: SMD  编带  0402  BTR04G02  B-tron  ROHS; Part Reference: D16; Part Number: A1D02.00002; Parameter: ESD-台舟 ESD5341N-封装 esd0402; ID: DE-E0004; Temp Coeff: -50℃ ~ +125℃; PCB Footprint: ESD_D0402; Value: BTR04G02; Part Type: 二极管-ESD管-桥堆-TVS管
J6 = LPJG0926HENL: DIP  母座  千兆网  带POE功能  18PIN  21.5*16*13.7mm  HRK1-1B71PG536A1BB-1R  镀镍  带指示灯  无弹片  左绿右黄  ROHS; Part Reference: J6; Part Number: A1J03.00012; Parameter: 连接器-带POE功能的集成变压器RJ45; Value: HRK1_1B71PG536A1BB_1R; Part Type: RJ45座
J7 = CON_2X2: DIP  排针座  2*2PIN  180度  2.54mm脚距  中间朔高2.5mm  针长一端6.1mm  另一端3.0mm  黑色  PH2.54 2*02P L=11.6/3.0  S/T  国意英  ROHS; Part Reference: J7; Part Number: A1J01.00011; Temp Coeff: -40℃ to +105℃; Preferred: 6715f349cd0bc5; Part Type: 排座
L16 = BCMEF122P900H: SMD  BCMEF122P900H  90R  6PIN  带ESD  ±25%  B-tron  ROHS; Part Number: A1L03.00001; Part Reference: L16; Temp Coeff: -40℃ to +105℃; Preferred: 6715f349cd0bc5; PCB Footprint: CML_SM6_0D55_1; Value: BCMEF122P900H; Part Type: 共模电感
L17 = BCMEF122P900H: SMD  BCMEF122P900H  90R  6PIN  带ESD  ±25%  B-tron  ROHS; Part Number: A1L03.00001; Part Reference: L17; Temp Coeff: -40℃ to +105℃; Preferred: 6715f349cd0bc5; PCB Footprint: CML_SM6_0D55_1; Value: BCMEF122P900H; Part Type: 共模电感
L18 = BCMEF122P900H: SMD  BCMEF122P900H  90R  6PIN  带ESD  ±25%  B-tron  ROHS; Part Number: A1L03.00001; Part Reference: L18; Temp Coeff: -40℃ to +105℃; Preferred: 6715f349cd0bc5; PCB Footprint: CML_SM6_0D55_1; Value: BCMEF122P900H; Part Type: 共模电感
L19 = BCMEF122P900H: SMD  BCMEF122P900H  90R  6PIN  带ESD  ±25%  B-tron  ROHS; Part Number: A1L03.00001; Part Reference: L19; Temp Coeff: -40℃ to +105℃; Preferred: 6715f349cd0bc5; PCB Footprint: CML_SM6_0D55_1; Value: BCMEF122P900H; Part Type: 共模电感
R237 = R: SMD  0201  0R  1/20W  ±5%  ROHS; Part Reference: R237; Part Number: A1R01.00027; PCB Footprint: R0201; Temp Coeff: －55℃ ~ ＋125℃; Value: 0R 5%; Part Type: 贴片电阻
R238 = R: SMD  0201  510R  1/20W  ±5%  ROHS; Part Reference: R238; Part Number: A1R01.00019; PCB Footprint: R0201; Value: 510R 5%; Part Type: 贴片电阻
R239 = R: SMD  0201  0R  1/20W  ±5%  ROHS; Part Reference: R239; Part Number: A1R01.00027; PCB Footprint: R0201; Temp Coeff: －55℃ ~ ＋125℃; Value: NC/0R 5%; Part Type: 贴片电阻
R241 = R: SMD  0201  0R  1/20W  ±5%  ROHS; Part Reference: R241; Part Number: A1R01.00027; PCB Footprint: R0201; Temp Coeff: －55℃ ~ ＋125℃; Value: NC/0R 5%; Part Type: 贴片电阻
R242 = R: SMD  0201  0R  1/20W  ±5%  ROHS; Part Reference: R242; Part Number: A1R01.00027; PCB Footprint: R0201; Temp Coeff: －55℃ ~ ＋125℃; Value: NC/0R 5%; Part Type: 贴片电阻
R248 = R: SMD  0201  0R  1/20W  ±5%  ROHS; Part Reference: R248; Part Number: A1R01.00027; PCB Footprint: R0201; Temp Coeff: －55℃ ~ ＋125℃; Value: NC/0R 5%; Part Type: 贴片电阻
R252 = R: SMD  0201  0R  1/20W  ±5%  ROHS; Part Reference: R252; Part Number: A1R01.00027; PCB Footprint: R0201; Temp Coeff: －55℃ ~ ＋125℃; Value: 0R 5%; Part Type: 贴片电阻
R253 = R: SMD  0201  510R  1/20W  ±5%  ROHS; Part Reference: R253; Part Number: A1R01.00019; PCB Footprint: R0201; Value: 510R 5%; Part Type: 贴片电阻
*#12 = radxa_1010: Page Create Date: March  8, 1995; Page Size: =PageSize; Page Modify Date: =ModifiedDate

## Sheet 15 MicroSD Card.SchDoc: CM4 IO
size 297 x 209 mm; Page Create Date: March  8, 1995; Page Number: 15; Page Size: A4; Comment: radxa_1010; Page Count: 19; RevCode: V1.10; Doc: 15 MicroSD Card; DsnPath: D:\WMS\黄工\[RC126]CM4_IO_V1.10\[RC126]_V1.10\CM4 IO_V1.10.DSN; SchematicName: CM4 IO V1.10; PageName: 15 MicroSD Card; PageSize: A4; TopSchematic: True
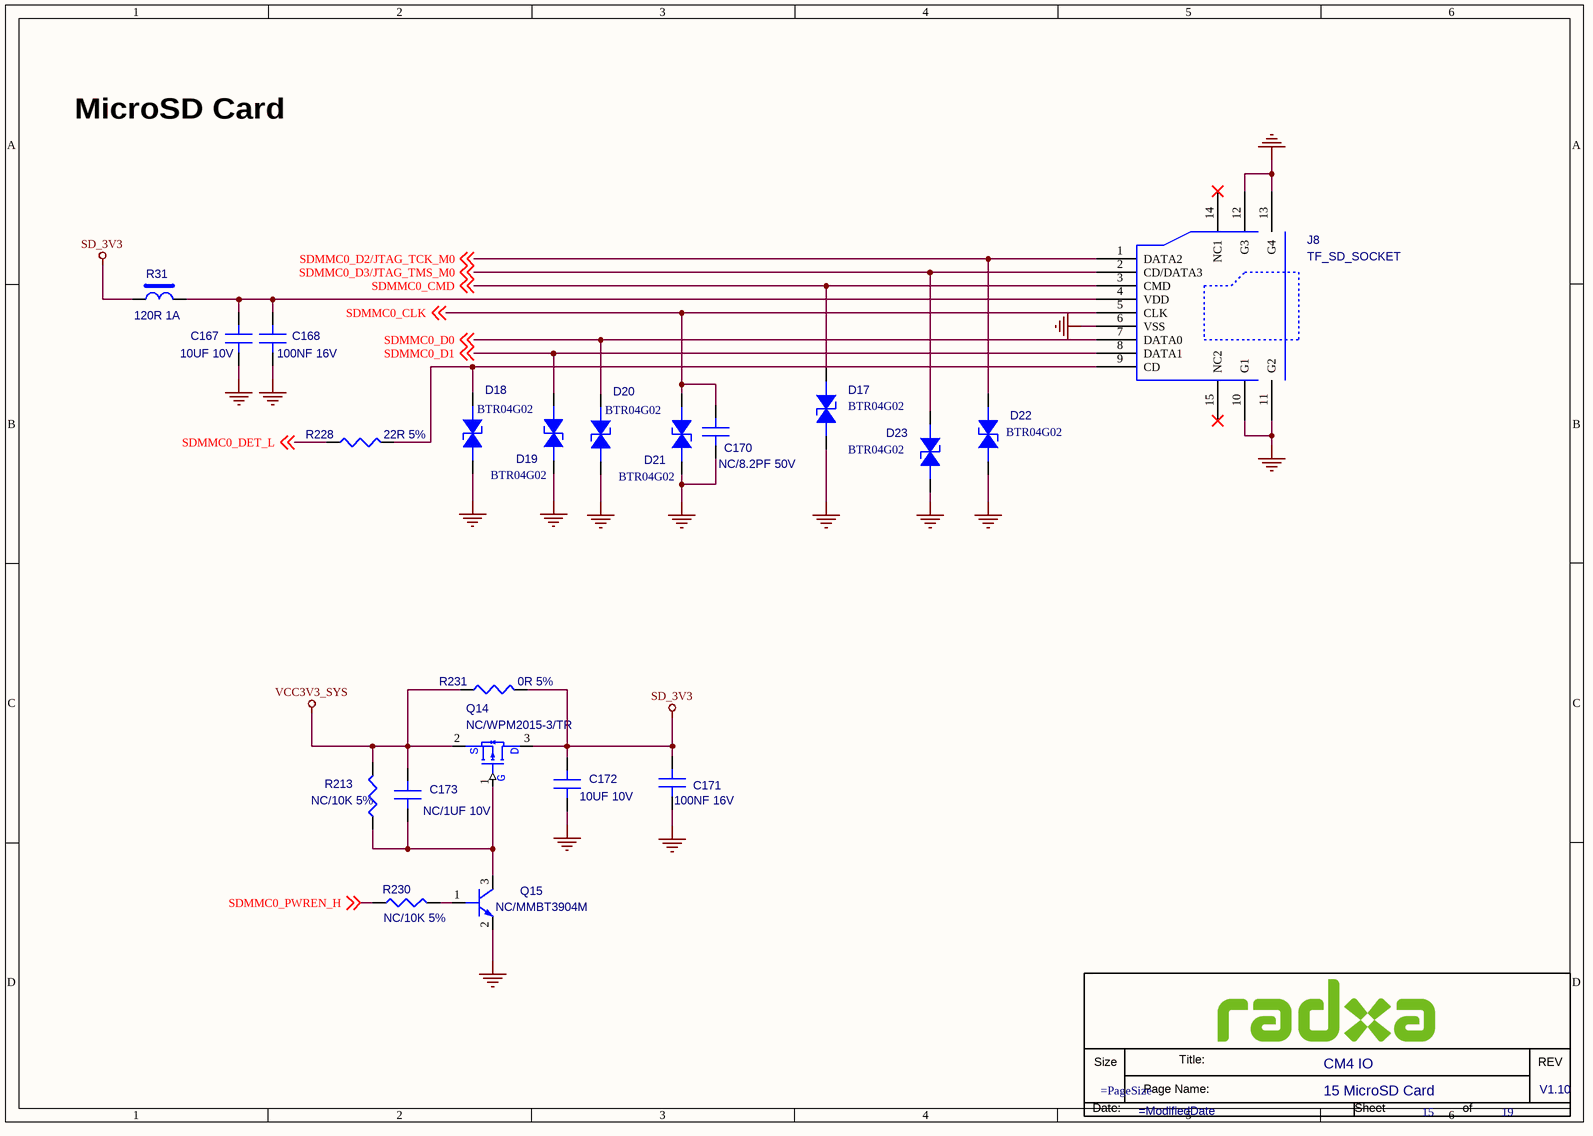
[diagram p12: 15 MicroSD Card.SchDoc]

### Parts
(Parts that share a designator on the sheet are numbered #1, #2 ... from top to bottom, then left to right.)
*#13  Doc: 15 MicroSD Card  RevCode: V1.10  Title: CM4 IO  Page Number: 15  Page Count: 19  (hidden comment: radxa_1010)  (graphical)
C167  10UF 10V  [C0603]
C168  100NF 16V  [C0201]
C170  NC/8.2PF 50V  [C0201]
C171  100NF 16V  [C0201]
C172  10UF 10V  [C0603]
C173  NC/1UF 10V  [C0201]
D17  BTR04G02  [DFN1006-2L]
D18  BTR04G02  [DFN1006-2L]
D19  BTR04G02  [DFN1006-2L]
D20  BTR04G02  [DFN1006-2L]
D21  BTR04G02  [DFN1006-2L]
D22  BTR04G02  [DFN1006-2L]
D23  BTR04G02  [DFN1006-2L]
J8  TF_SD_SOCKET  [SD_SM9_1D1_15D75]
Q14  NC/WPM2015-3/TR  [SOT_23]
Q15  NC/MMBT3904M  [SOT_723]
R31  120R 1A  [FB0201]
R213  NC/10K 5%  [R0402]
R228  22R 5%  [R0402]
R230  NC/10K 5%  [R0402]
R231  0R 5%  [R0402]

### Nets
GND: C167.2(B) C168.2(B) C170.2(B) C171.2(B) C172.2(B) D17.1(ANODE) D18.1(ANODE) D19.1(ANODE) D20.1(ANODE) D21.1(ANODE) D22.1(ANODE) D23.1(ANODE) J8.6(VSS) J8.10(G1) J8.11(G2) J8.12(G3) J8.13(G4) Q15.2(EMITTER)
SD_3V3: C171.1(A) C172.1(A) Q14.3(D) R31.1 R231.2
VCC3V3_SYS: C173.1(A) Q14.2(S) R213.2 R231.1
SDMMC0_CLK: C170.1(A) D21.2(CATHODE) J8.5(CLK) ; off-sheet SDMMC0_CLK
SDMMC0_CMD: D17.2(CATHODE) J8.3(CMD) ; off-sheet SDMMC0_CMD
SDMMC0_D0: D20.2(CATHODE) J8.7(DATA0) ; off-sheet SDMMC0_D0
SDMMC0_D1: D19.2(CATHODE) J8.8(DATA1) ; off-sheet SDMMC0_D1
SDMMC0_D2/JTAG_TCK_M0: D22.2(CATHODE) J8.1(DATA2) ; off-sheet SDMMC0_D2/JTAG_TCK_M0
SDMMC0_D3/JTAG_TMS_M0: D23.2(CATHODE) J8.2(CD/DATA3) ; off-sheet SDMMC0_D3/JTAG_TMS_M0
SDMMC0_DET_L: R228.1 ; off-sheet SDMMC0_DET_L
SDMMC0_PWREN_H: R230.1 ; off-sheet SDMMC0_PWREN_H
NetC167_1: C167.1(A) C168.1(A) J8.4(VDD) R31.2
NetC173_2: C173.2(B) Q14.1(G) Q15.3(COLLECTOR) R213.1
NetD18_2: D18.2(CATHODE) J8.9(CD) R228.2
NetQ15_1: Q15.1(BASE) R230.2

Not connected (* = marked no-connect by the designer): J8 14(NC1)* 15(NC2)*

### Notes on the sheet
- MicroSD Card
- (in symbol radxa_1010) Size; Title:; REV; Page Name:; Date:; Sheet; of

### Library data of the parts
C167 = C: SMD  0603  10UF  10V  X5R  ±10%  ROHS; PARTS: 1; Part Reference: C167; Part Number: A1C01.00270; OriginalSymbolOrigin: (0,30); PKG_TYPE: CAP2-100-250; LEVEL: STD; PINSWAP: (A,B); Value: 10UF 10V; Part Type: 陶瓷电容; PCB Footprint: C0603
C168 = C: SMD  0201  100NF  16V  X5R  ±20%  ROHS; PARTS: 1; Part Reference: C168; Part Number: A1C01.00099; OriginalSymbolOrigin: (0,30); PKG_TYPE: CAP2-100-250; LEVEL: STD; PINSWAP: (A,B); Preferred: 6715f349cd0bc5; Value: 100NF 16V; Part Type: 陶瓷电容
C170 = C: SMD  0201  8.2PF  50V  NPO  ±5%  ROHS; PARTS: 1; Part Reference: C170; Part Number: A1C01.00147; OriginalSymbolOrigin: (0,30); PKG_TYPE: CAP2-100-250; LEVEL: STD; PINSWAP: (A,B); Value: NC/8.2PF 50V; Part Type: 陶瓷电容; PCB Footprint: C0201
C171 = C: SMD  0201  100NF  16V  X5R  ±20%  ROHS; PARTS: 1; Part Reference: C171; Part Number: A1C01.00099; OriginalSymbolOrigin: (0,30); PKG_TYPE: CAP2-100-250; LEVEL: STD; PINSWAP: (A,B); Preferred: 6715f349cd0bc5; Value: 100NF 16V; Part Type: 陶瓷电容
C172 = C: SMD  0603  10UF  10V  X5R  ±20%  ROHS; PARTS: 1; Part Reference: C172; Part Number: A1C01.00075; OriginalSymbolOrigin: (0,30); PKG_TYPE: CAP2-100-250; LEVEL: STD; PINSWAP: (A,B); Value: 10UF 10V; PCB Footprint: C0603; Part Type: 陶瓷电容
C173 = C: SMD  0201  1UF  10V  X5R  ±20%  ROHS; PARTS: 1; Part Reference: C173; Part Number: A1C01.00081; OriginalSymbolOrigin: (0,30); PKG_TYPE: CAP2-100-250; LEVEL: STD; PINSWAP: (A,B); Value: NC/1UF 10V; PCB Footprint: C0201; Part Type: 陶瓷电容
D17 = ESD: SMD  编带  0402  BTR04G02  B-tron  ROHS; Part Reference: D17; Part Number: A1D02.00002; Parameter: ESD-台舟 ESD5341N-封装 esd0402; ID: DE-E0004; Temp Coeff: -50℃ ~ +125℃; PCB Footprint: ESD_D0402; Value: BTR04G02; Part Type: 二极管-ESD管-桥堆-TVS管
D18 = ESD: SMD  编带  0402  BTR04G02  B-tron  ROHS; Part Reference: D18; Part Number: A1D02.00002; Parameter: ESD-台舟 ESD5341N-封装 esd0402; ID: DE-E0004; Temp Coeff: -50℃ ~ +125℃; PCB Footprint: ESD_D0402; Value: BTR04G02; Part Type: 二极管-ESD管-桥堆-TVS管
D19 = ESD: SMD  编带  0402  BTR04G02  B-tron  ROHS; Part Reference: D19; Part Number: A1D02.00002; Parameter: ESD-台舟 ESD5341N-封装 esd0402; ID: DE-E0004; Temp Coeff: -50℃ ~ +125℃; PCB Footprint: ESD_D0402; Value: BTR04G02; Part Type: 二极管-ESD管-桥堆-TVS管
D20 = ESD: SMD  编带  0402  BTR04G02  B-tron  ROHS; Part Reference: D20; Part Number: A1D02.00002; Parameter: ESD-台舟 ESD5341N-封装 esd0402; ID: DE-E0004; Temp Coeff: -50℃ ~ +125℃; PCB Footprint: ESD_D0402; Value: BTR04G02; Part Type: 二极管-ESD管-桥堆-TVS管
D21 = ESD: SMD  编带  0402  BTR04G02  B-tron  ROHS; Part Reference: D21; Part Number: A1D02.00002; Parameter: ESD-台舟 ESD5341N-封装 esd0402; ID: DE-E0004; Temp Coeff: -50℃ ~ +125℃; PCB Footprint: ESD_D0402; Value: BTR04G02; Part Type: 二极管-ESD管-桥堆-TVS管
D22 = ESD: SMD  编带  0402  BTR04G02  B-tron  ROHS; Part Reference: D22; Part Number: A1D02.00002; Parameter: ESD-台舟 ESD5341N-封装 esd0402; ID: DE-E0004; Temp Coeff: -50℃ ~ +125℃; PCB Footprint: ESD_D0402; Value: BTR04G02; Part Type: 二极管-ESD管-桥堆-TVS管
D23 = ESD: SMD  编带  0402  BTR04G02  B-tron  ROHS; Part Reference: D23; Part Number: A1D02.00002; Parameter: ESD-台舟 ESD5341N-封装 esd0402; ID: DE-E0004; Temp Coeff: -50℃ ~ +125℃; PCB Footprint: ESD_D0402; Value: BTR04G02; Part Type: 二极管-ESD管-桥堆-TVS管
J8 = TF_SD_SOCKET: SMD  XKTF-N02-N  14.7*14.8*H1.95mm  9PIN  不锈钢  星坤  ROHS; Part Reference: J8; Part Number: A1J09.00014; Preferred: 6715f349cd0bc5; Temp Coeff: -30℃ to +80℃; Value: TF_SD_SOCKET; Part Type: 卡座
Q14 = MOSFET_PNP: SMD编带  SOT-23  WPM2015-3/TR  P沟道  ROHS; Part Reference: Q14; Part Number: A1D01.00019; Temp Coeff: -55℃ to ＋150℃; Value: NC/WPM2015-3/TR; Part Type: 三极管-MOS管; PCB Footprint: SOT_23
Q15 = NPN: SMD编带  SOT-723  MMBT3904M  NPN  ROHS; Part Reference: Q15; Manufacturer PN: S8050_SOT23; Manufacturer: 长电; Part Number: A1D01.00002; Pc: 0.3W; Vceo: 25V; Ic: 0.5A; Priority: A; RK PN: S8050; Temp Coeff: -55℃ to ＋150℃; PCB Footprint: SOT_723; Value: NC/MMBT3904M; Created by: JJJ; Part Type: 三极管-MOS管
R31 = BEAD: SMD  0201  FB120R  1A  MPZ0603S121HT000  ±25%  ROHS; Part Reference: R31; Part Number: A1L09.00033; PCB Footprint: FB0201; Value: 120R 1A; Part Type: 贴片磁珠
R213 = R: SMD  0201  10K  1/20W  ±5%  ROHS; Part Reference: R213; Part Number: A1R01.00012; PCB Footprint: R0201; Temp Coeff: －55℃ ~ ＋125℃; Value: NC/10K 5%; Part Type: 贴片电阻
R228 = R: SMD  0201  22R  1/20W  ±5%  ROHS; Part Reference: R228; Part Number: A1R01.00024; PCB Footprint: R0201; Temp Coeff: -55℃ to +125℃; Preferred: 6715f349cd0bc5; Value: 22R 5%; Part Type: 贴片电阻
R230 = R: SMD  0201  10K  1/20W  ±5%  ROHS; Part Reference: R230; Part Number: A1R01.00012; PCB Footprint: R0201; Temp Coeff: －55℃ ~ ＋125℃; Value: NC/10K 5%; Part Type: 贴片电阻
R231 = R: SMD  0201  0R  1/20W  ±5%  ROHS; Part Reference: R231; Part Number: A1R01.00027; PCB Footprint: R0201; Temp Coeff: -55℃ to +125℃; Preferred: 6715f349cd0bc5; Value: 0R 5%; Part Type: 贴片电阻
*#13 = radxa_1010: Page Create Date: March  8, 1995; Page Size: =PageSize; Page Modify Date: =ModifiedDate